# EAGLE design usb-fanctl (EAGLE 9.6.2)
CREVISION: 1; DESIGNER: Joao Silva
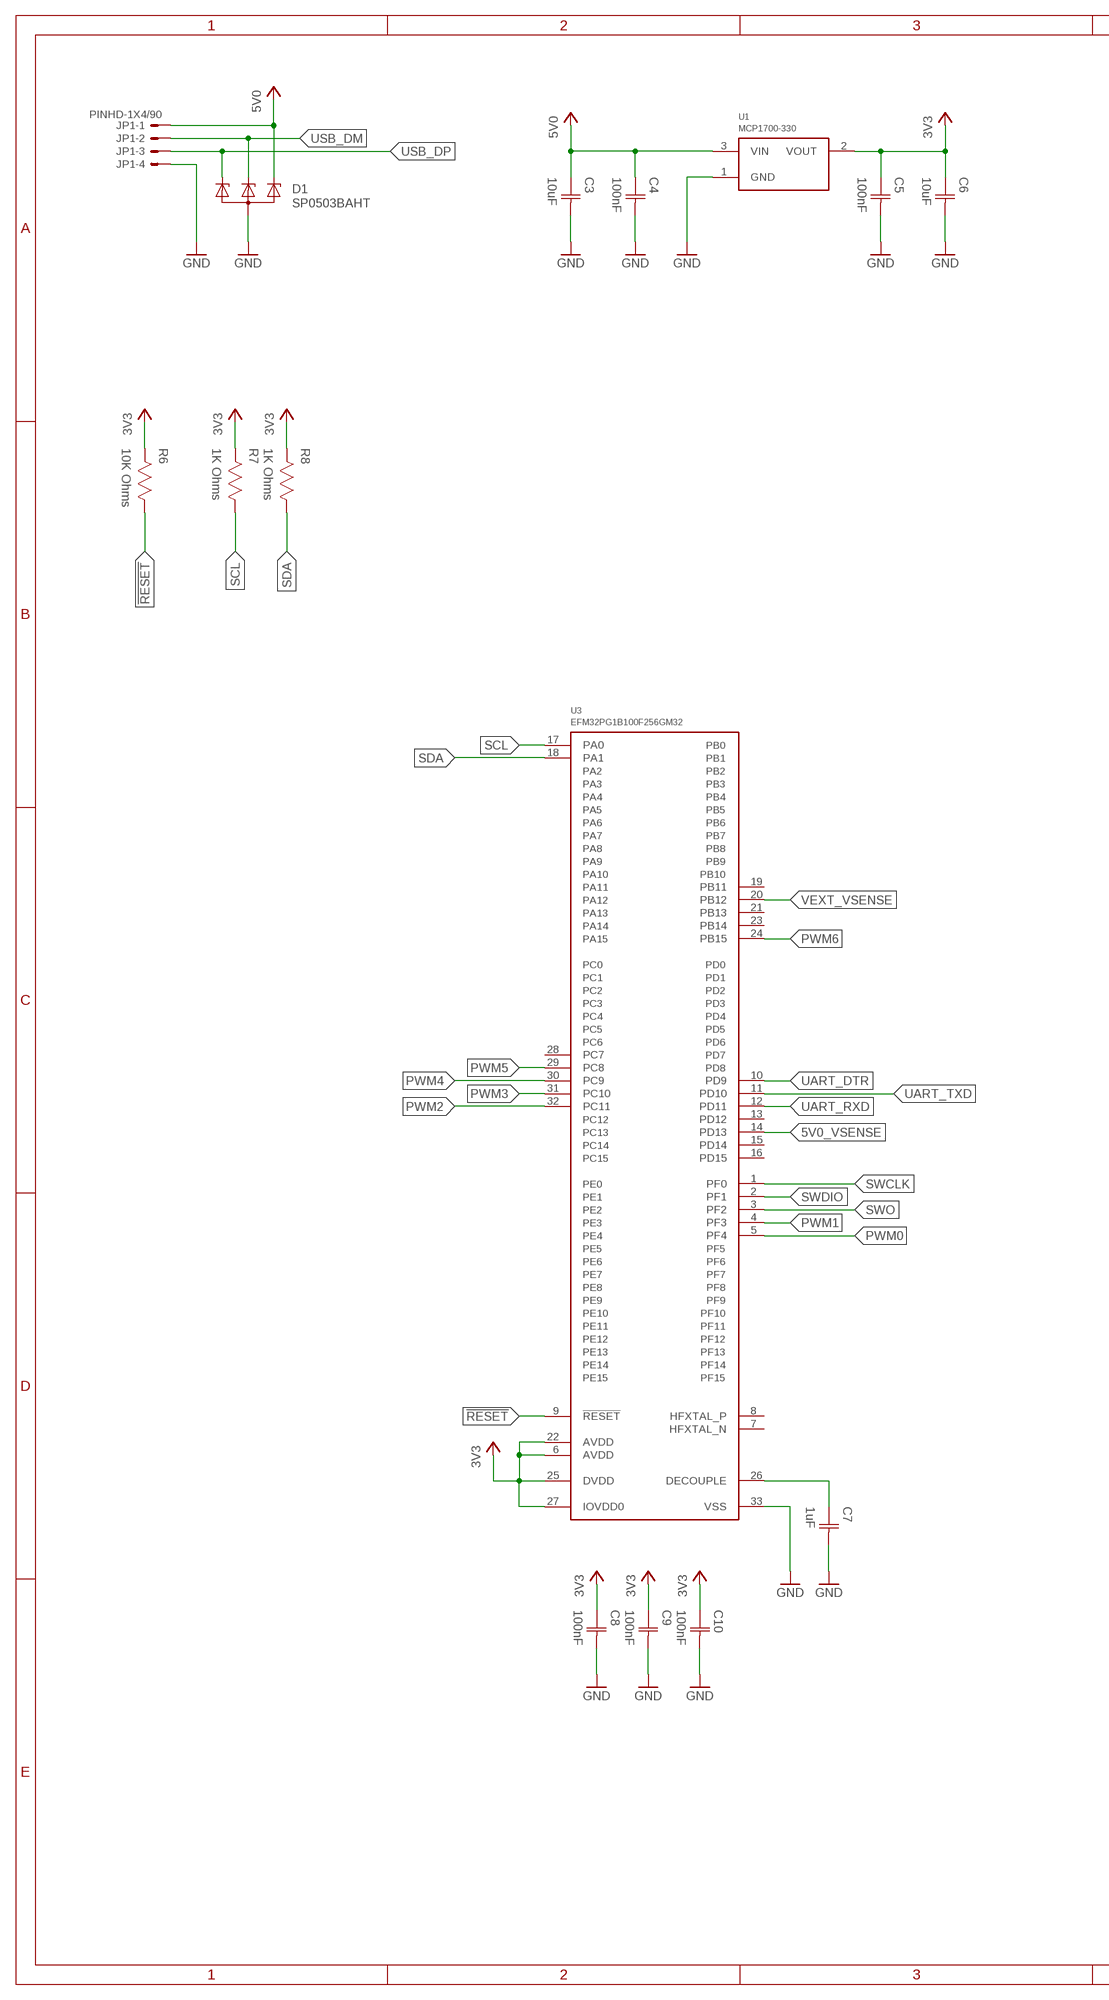
[diagram p0: schematic, sheet 1, part 1 of 2]
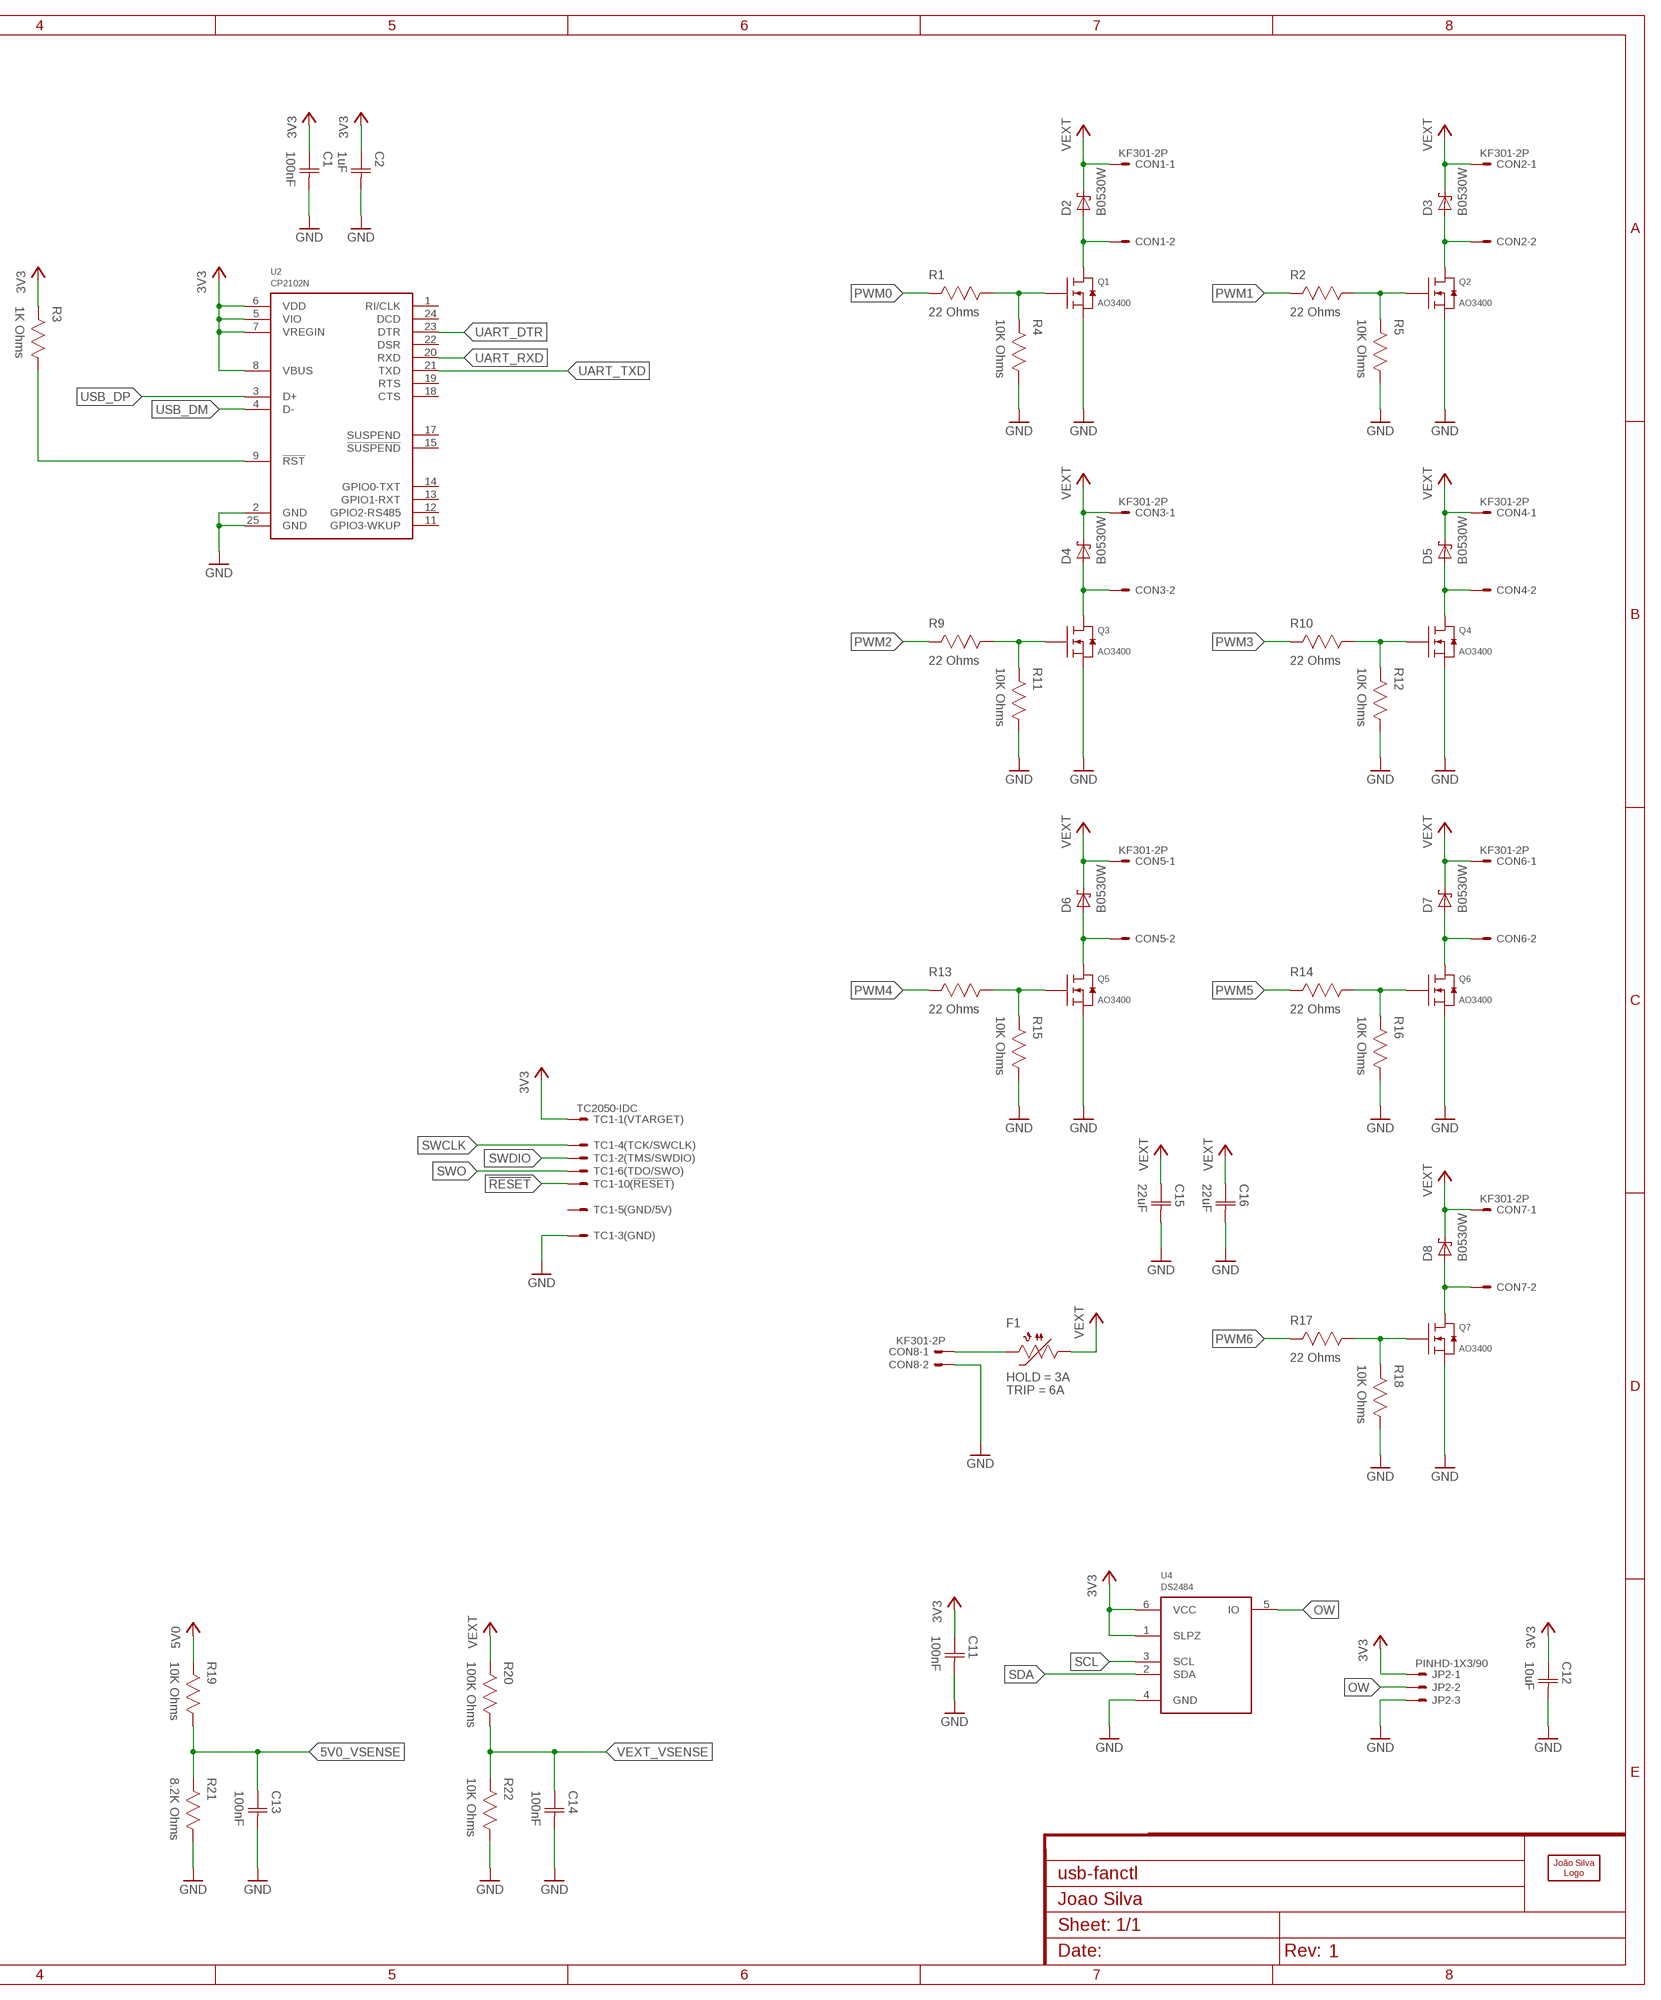
[diagram p1: schematic, sheet 1, part 2 of 2]

## Parts
C1  100nF  CAPACITOR-0402  [CAP0402]
C2  1uF  CAPACITOR-0402  [CAP0402]
C3  10uF  CAPACITOR-0603  [CAP0603]
C4  100nF  CAPACITOR-0402  [CAP0402]
C5  100nF  CAPACITOR-0402  [CAP0402]
C6  10uF  CAPACITOR-0603  [CAP0603]
C7  1uF  CAPACITOR-0402  [CAP0402]
C8  100nF  CAPACITOR-0402  [CAP0402]
C9  100nF  CAPACITOR-0402  [CAP0402]
C10  100nF  CAPACITOR-0402  [CAP0402]
C11  100nF  CAPACITOR-0402  [CAP0402]
C12  10uF  CAPACITOR-0603  [CAP0603]
C13  100nF  CAPACITOR-0402  [CAP0402]
C14  100nF  CAPACITOR-0402  [CAP0402]
C15  22uF  CAPACITOR-1206  [CAP1206]
C16  22uF  CAPACITOR-1206  [CAP1206]
CON1  KF301-2P  [KF301-2P]
CON2  KF301-2P  [KF301-2P]
CON3  KF301-2P  [KF301-2P]
CON4  KF301-2P  [KF301-2P]
CON5  KF301-2P  [KF301-2P]
CON6  KF301-2P  [KF301-2P]
CON7  KF301-2P  [KF301-2P]
CON8  KF301-2P  [KF301-2P]
D1  SP0503BAHT  [SOT143]
D2  B0530W  [SOD-123]
D3  B0530W  [SOD-123]
D4  B0530W  [SOD-123]
D5  B0530W  [SOD-123]
D6  B0530W  [SOD-123]
D7  B0530W  [SOD-123]
D8  B0530W  [SOD-123]
F1  PTC1206  [1206]
JP1  PINHD-1X4/90  [1X04/90]
JP2  PINHD-1X3/90  [1X03/90]
LOGO1  JS-5MM  [JS_5MM]
Q1  AO3400  [SOT23]
Q2  AO3400  [SOT23]
Q3  AO3400  [SOT23]
Q4  AO3400  [SOT23]
Q5  AO3400  [SOT23]
Q6  AO3400  [SOT23]
Q7  AO3400  [SOT23]
R1  22 Ohms  RESISTOR-0402  [RES0402]
R2  22 Ohms  RESISTOR-0402  [RES0402]
R3  1K Ohms  RESISTOR-0402  [RES0402]
R4  10K Ohms  RESISTOR-0402  [RES0402]
R5  10K Ohms  RESISTOR-0402  [RES0402]
R6  10K Ohms  RESISTOR-0402  [RES0402]
R7  1K Ohms  RESISTOR-0402  [RES0402]
R8  1K Ohms  RESISTOR-0402  [RES0402]
R9  22 Ohms  RESISTOR-0402  [RES0402]
R10  22 Ohms  RESISTOR-0402  [RES0402]
R11  10K Ohms  RESISTOR-0402  [RES0402]
R12  10K Ohms  RESISTOR-0402  [RES0402]
R13  22 Ohms  RESISTOR-0402  [RES0402]
R14  22 Ohms  RESISTOR-0402  [RES0402]
R15  10K Ohms  RESISTOR-0402  [RES0402]
R16  10K Ohms  RESISTOR-0402  [RES0402]
R17  22 Ohms  RESISTOR-0402  [RES0402]
R18  10K Ohms  RESISTOR-0402  [RES0402]
R19  10K Ohms  RESISTOR-0402  [RES0402]
R20  100K Ohms  RESISTOR-0402  [RES0402]
R21  8.2K Ohms  RESISTOR-0402  [RES0402]
R22  10K Ohms  RESISTOR-0402  [RES0402]
TC1  TC2050-IDC  [TC2050-IDC]
U1  MCP1700-330  [SOT23]
U2  CP2102N  [QFN24]
U3  EFM32PG1B100F256GM32  [QFN32_0.5P_JPG]
U4  DS2484  [SOT23-6]

## Nets
3V3: C1.1(C1) C2.1(C1) C5.1(C1) C6.1(C1) C8.1(C1) C9.1(C1) C10.1(C1) C11.1(C1) C12.1(C1) JP2.1 R3.2 R6.2 R7.2 R8.2 TC1.1 U1.2(VOUT) U2.5(VIO) U2.6(VDD) U2.7(VREGIN) U2.8(VBUS) U3.6(AVDD) U3.22(AVDD) U3.25(DVDD) U3.27(IOVDD0) U4.1(SLPZ) U4.6(VCC)
5V0: C3.1(C1) C4.1(C1) D1.4(C3) JP1.1 R19.2 U1.3(VIN)
5V0_VSENSE: C13.1(C1) R19.1 R21.2 U3.14(PD13)
!RESET: R6.1 TC1.10 U3.9(!RESET)
GND: C1.2(C2) C2.2(C2) C3.2(C2) C4.2(C2) C5.2(C2) C6.2(C2) C7.2(C2) C8.2(C2) C9.2(C2) C10.2(C2) C11.2(C2) C12.2(C2) C13.2(C2) C14.2(C2) C15.2(C2) C16.2(C2) CON8.2 D1.1(A) JP1.4 JP2.3 Q1.2(S) Q2.2(S) Q3.2(S) Q4.2(S) Q5.2(S) Q6.2(S) Q7.2(S) R4.1 R5.1 R11.1 R12.1 R15.1 R16.1 R18.1 R21.1 R22.1 TC1.3 U1.1(GND) U2.2(GND) U2.25(GND) U3.33(VSS) U4.4(GND)
N$1: Q2.1(G) R2.1 R5.2
N$2: CON2.2 D3.A Q2.3(D)
N$3: Q4.1(G) R10.1 R12.2
N$4: CON4.2 D5.A Q4.3(D)
N$5: Q6.1(G) R14.1 R16.2
N$6: CON6.2 D7.A Q6.3(D)
N$7: Q7.1(G) R17.1 R18.2
N$8: CON7.2 D8.A Q7.3(D)
N$9: Q1.1(G) R1.1 R4.2
N$10: CON1.2 D2.A Q1.3(D)
N$11: Q3.1(G) R9.1 R11.2
N$12: CON3.2 D4.A Q3.3(D)
N$13: Q5.1(G) R13.1 R15.2
N$14: CON5.2 D6.A Q5.3(D)
N$15: C7.1(C1) U3.26(DECOUPLE)
N$16: R3.1 U2.9(!RST)
OW: JP2.2 U4.5(IO)
PWM0: R1.2 U3.5(PF4)
PWM1: R2.2 U3.4(PF3)
PWM2: R9.2 U3.32(PC11)
PWM3: R10.2 U3.31(PC10)
PWM4: R13.2 U3.30(PC9)
PWM5: R14.2 U3.29(PC8)
PWM6: R17.2 U3.24(PB15)
SCL: R7.1 U3.17(PA0) U4.3(SCL)
SDA: R8.1 U3.18(PA1) U4.2(SDA)
SWCLK: TC1.4 U3.1(PF0)
SWDIO: TC1.2 U3.2(PF1)
SWO: TC1.6 U3.3(PF2)
UART_DTR: U2.23(DTR) U3.10(PD9)
UART_RXD: U2.20(RXD) U3.12(PD11)
UART_TXD: U2.21(TXD) U3.11(PD10)
USB_DM: D1.3(C2) JP1.2 U2.4(D-)
USB_DP: D1.2(C1) JP1.3 U2.3(D+)
VEXT: C15.1(C1) C16.1(C1) CON1.1 CON2.1 CON3.1 CON4.1 CON5.1 CON6.1 CON7.1 D2.C D3.C D4.C D5.C D6.C D7.C D8.C F1.1 R20.2
VEXT_UNFUSED: CON8.1 F1.2
VEXT_VSENSE: C14.1(C1) R20.1 R22.2 U3.20(PB12)
Unconnected: TC1.5 TC1.7 TC1.8 TC1.9 U2.1(RI/CLK) U2.11(GPIO3-WKUP) U2.12(GPIO2-RS485) U2.13(GPIO1-RXT) U2.14(GPIO0-TXT) U2.15(!SUSPEND) U2.17(SUSPEND) U2.18(CTS) U2.19(RTS) U2.22(DSR) U2.24(DCD) U3.7(HFXTAL_N) U3.8(HFXTAL_P) U3.13(PD12) U3.15(PD14) U3.16(PD15) U3.19(PB11) U3.21(PB13) U3.23(PB14) U3.28(PC7)

## Library data of the parts
C1-C16 = Capacitor:CAPACITOR
CON1-CON8 = Generic Connector:KF301-2P
D1 = TVS:SP0503BAHT
D2-D8 = Generic Diode:B0530W
F1 = Fuses:PTC; HOLD: 3A; TRIP: 6A
JP1 = Pin Header:PINHD-1X4: PIN HEADER
JP2 = Pin Header:PINHD-1X3: PIN HEADER
LOGO1 = Silkscreen:JS
Q1-Q7 = Alpha Omega:AO3400
R1-R22 = Resistor:RESISTOR
TC1 = TagConnect:TC2050-IDC
U1 = Microchip:MCP1700-*
U2 = Silicon Labs:CP2102N
U3 = EFM32:EFM32PG1B100F*M32
U4 = Maxim Integrated:DS2484

## Board
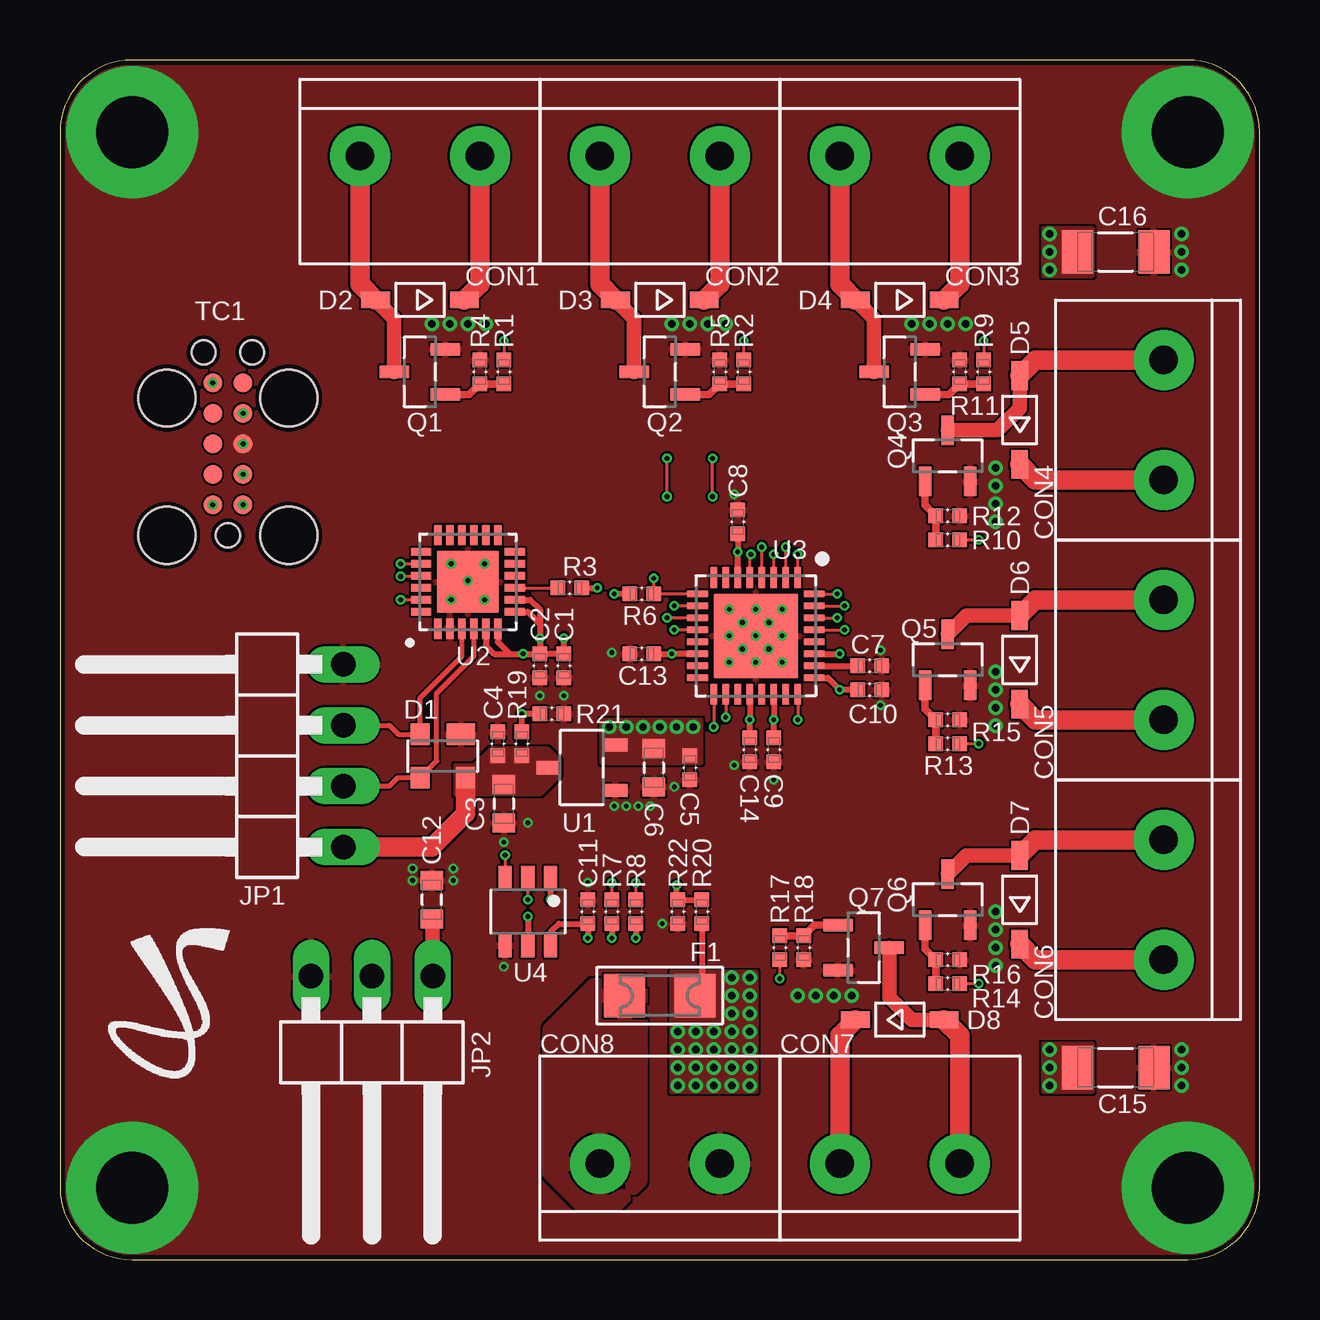
[diagram p2: board, top side]
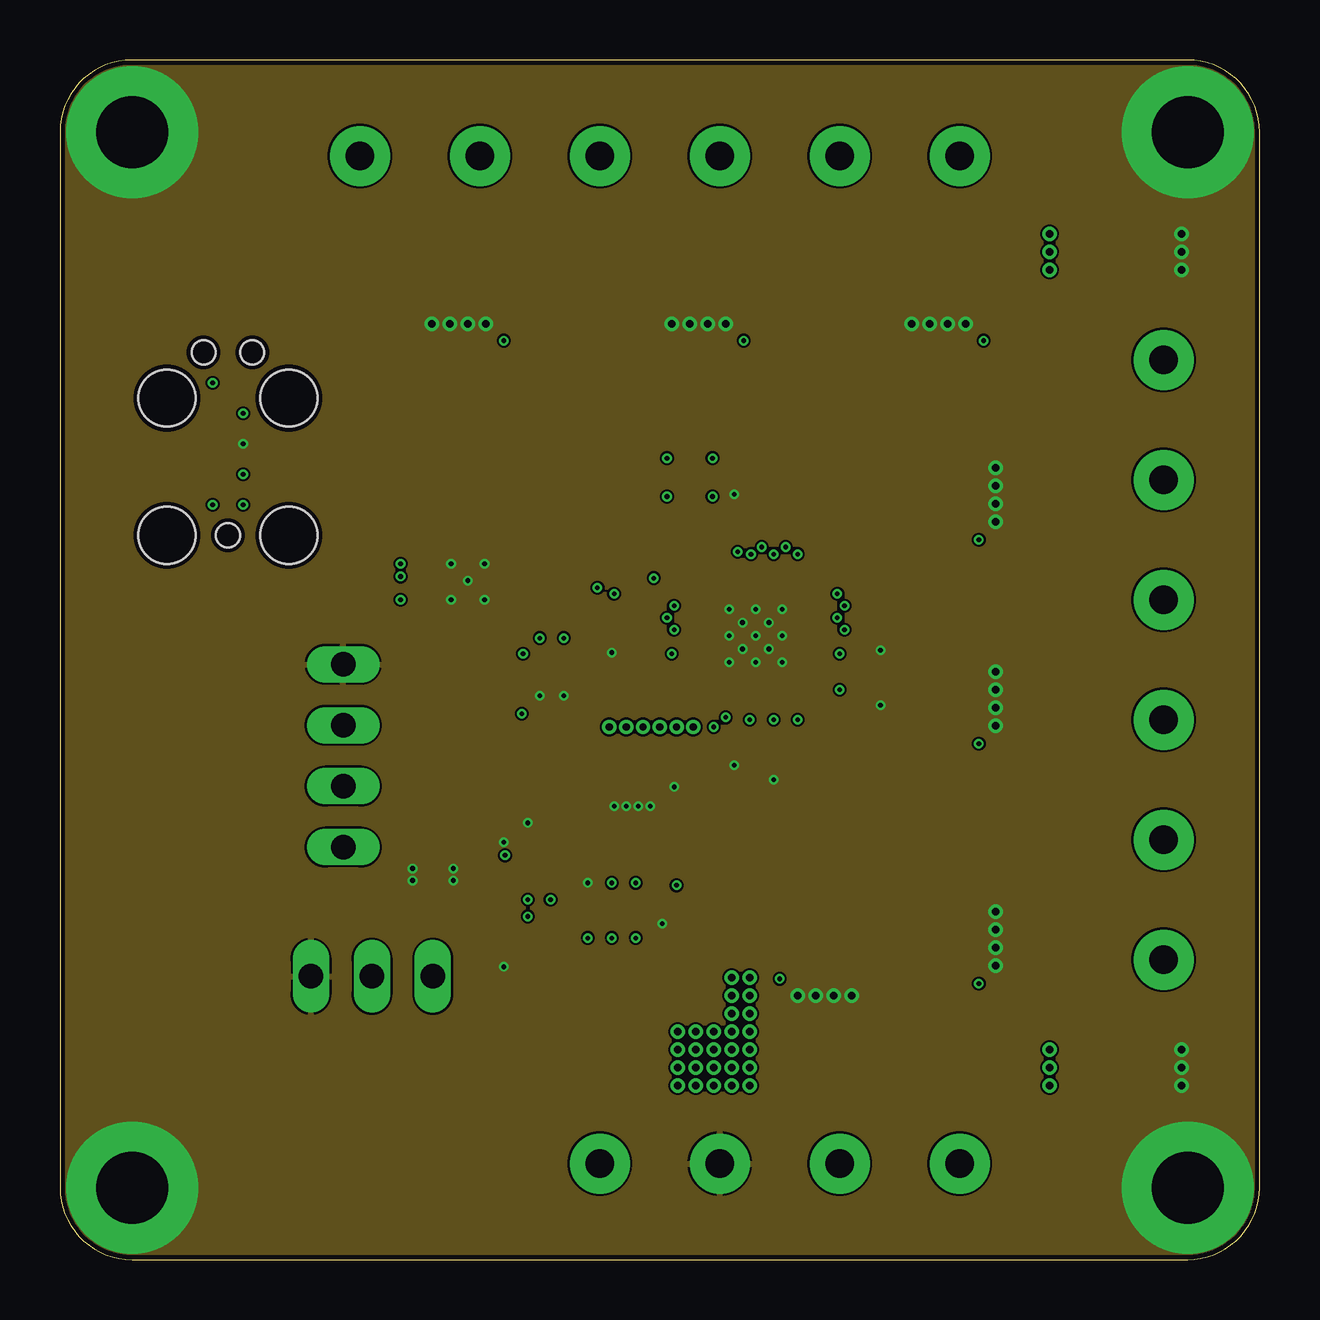
[diagram p3: board, inner layer Route2]
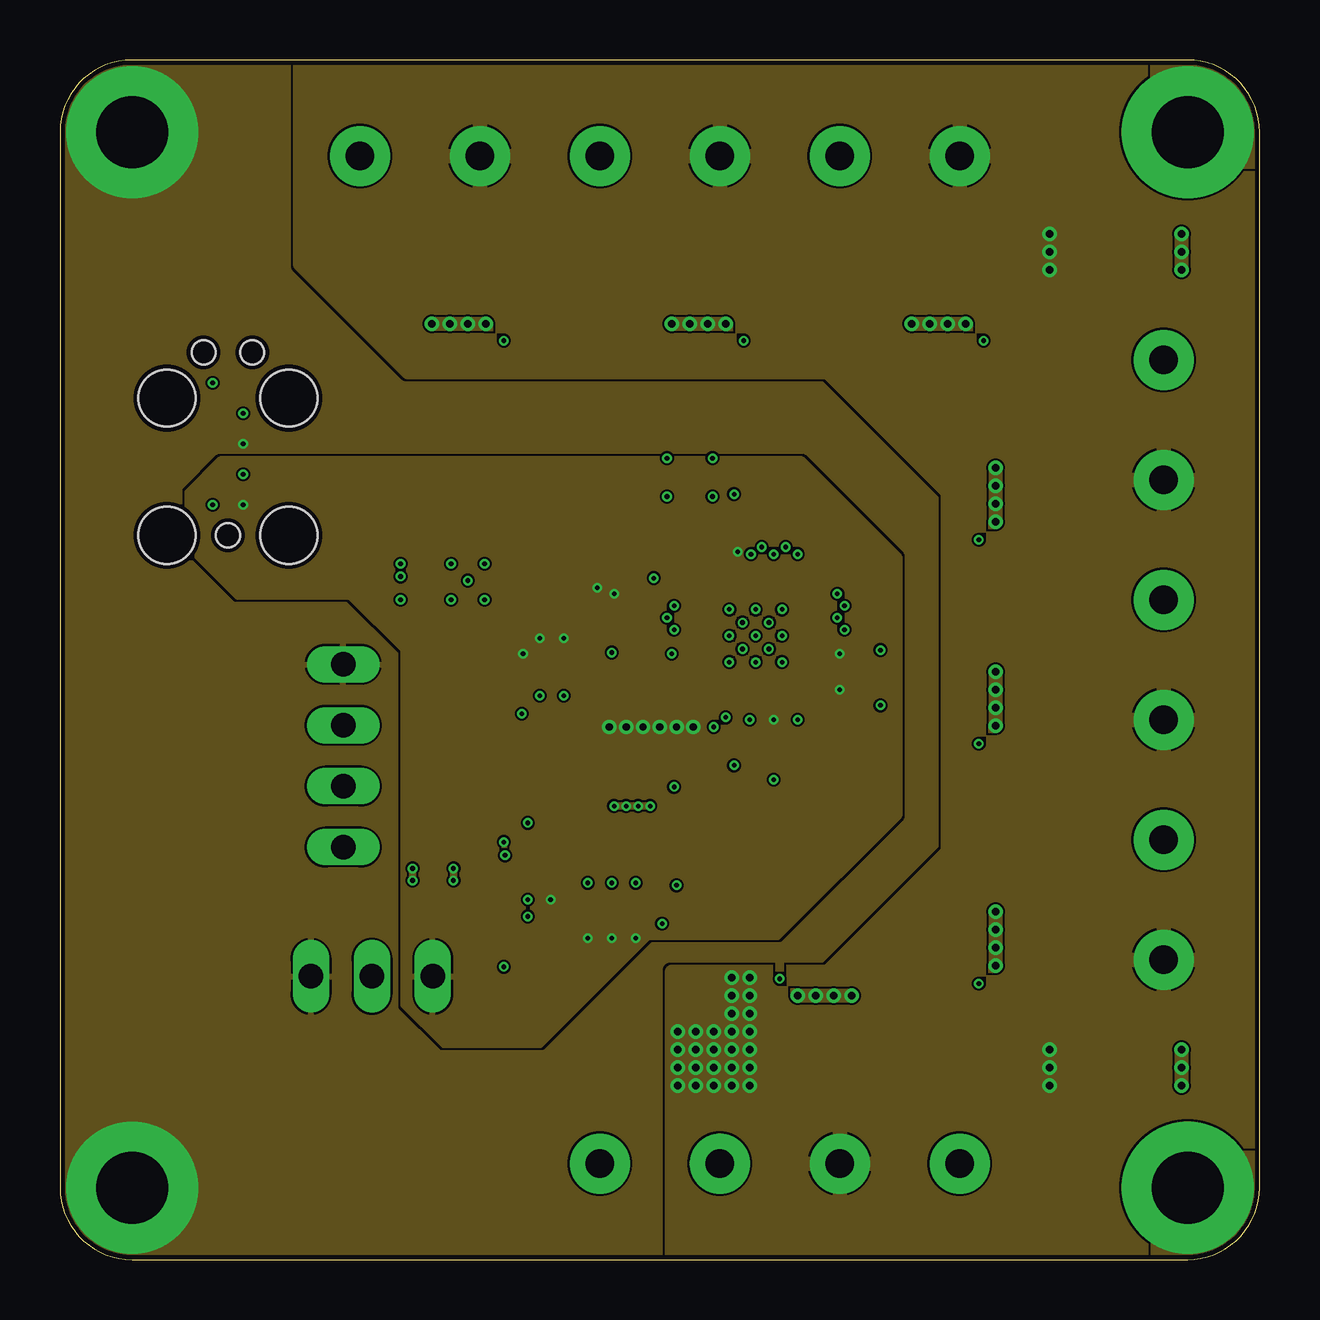
[diagram p4: board, inner layer Route15]
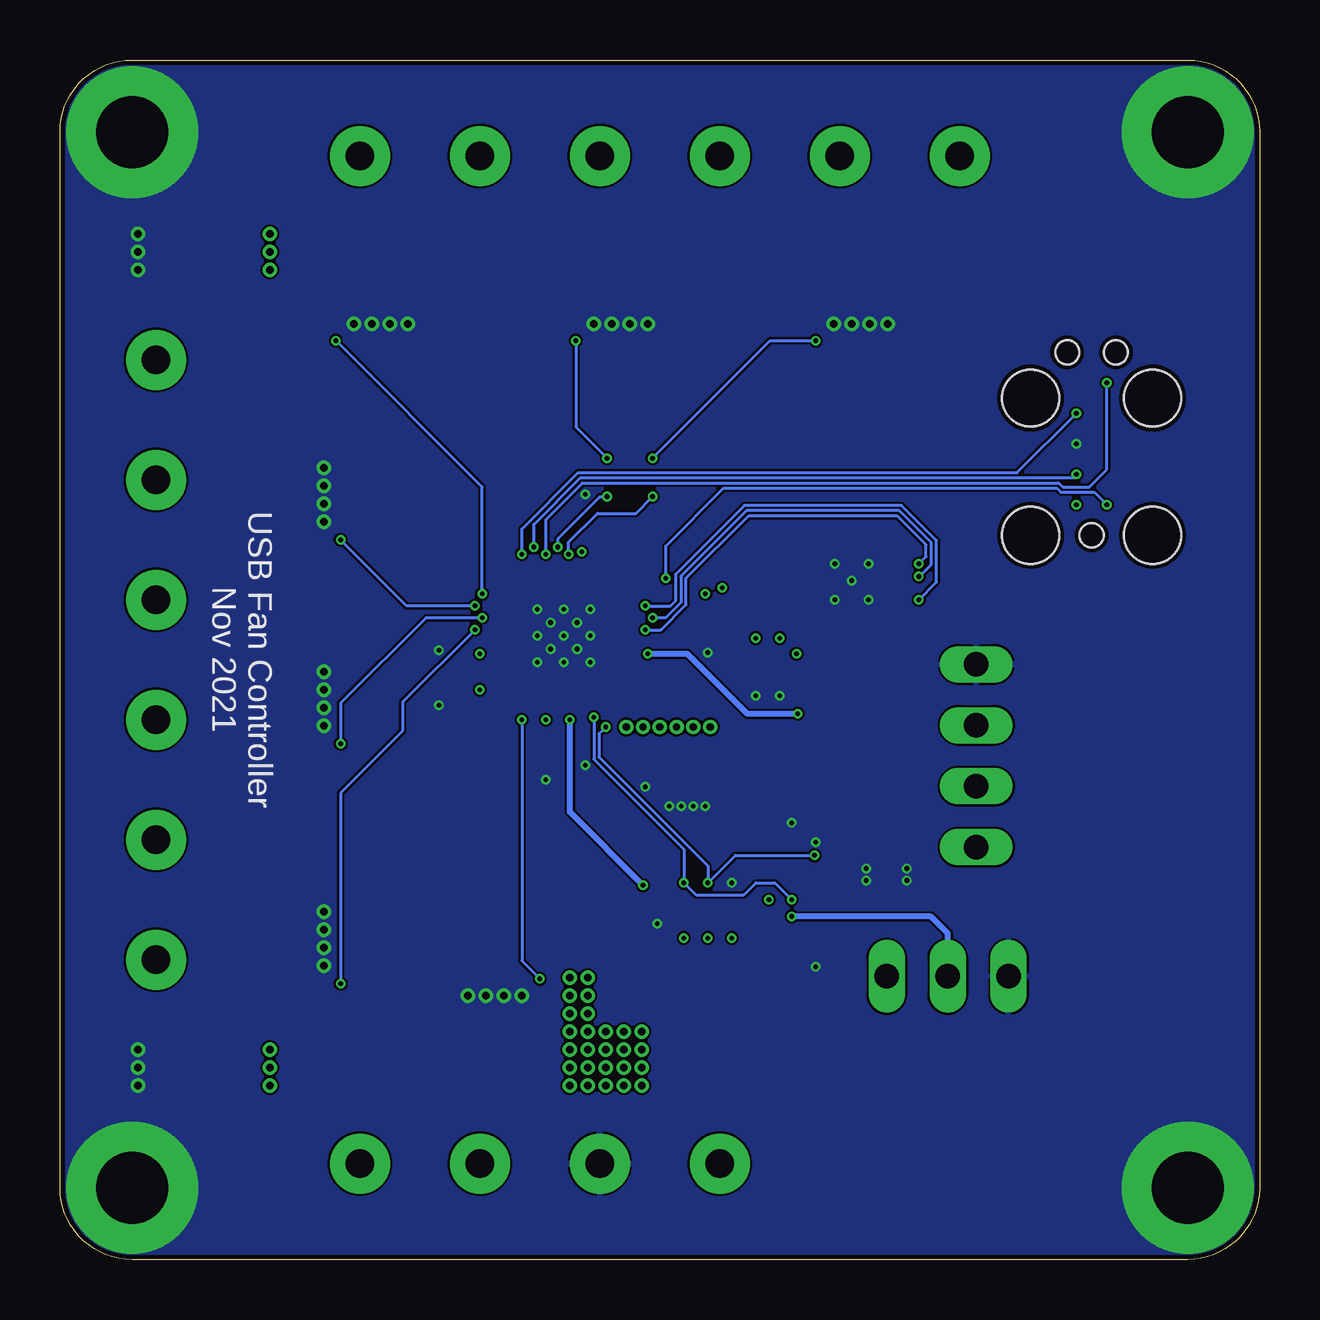
[diagram p5: board, bottom side, seen from below]

Size 50 x 50 mm. Coordinates in mm from the lower left corner, seen from the top.
Outline: 0,47 0,3 arc90 3,0 47,0 arc90 50,3 50,47 arc90 47,50 3,50 arc90 0,47
Copper layers (1+2*15+16): Top 0.035mm / dielectric 0.2mm / Route2 0.0175mm / dielectric 0.665mm / Route15 0.0175mm / dielectric 0.2mm / Bottom 0.035mm
Design rules "jlcpcb_4layer": minimum track width 3.5mil, minimum drill 0.2mm, track to track 3.5mil, track to pad 3.5mil, pad to pad 3.5mil, via to via 5mil, smd to smd 3.5mil, copper to edge 0.2mm, drill to drill 5mil, minimum pad ring 0.15mm, minimum via ring 0.1mm, stop-mask expansion 0.04mm, vias tented up to drill 10mm, thermal gap 3.5mil

### Footprints (pad centres in the part's own frame; a part is rotated, then mirrored left to right if it is on the bottom)
CAP0402 = smd 0.6 x 0.6: 1 -0.5,0; 2 0.5,0
CAP0603 = smd 0.8 x 0.95: 1 -0.8,0; 2 0.8,0
CAP1206 = smd 1.3 x 1.8: 1 -1.6,0; 2 1.6,0
KF301-2P = drill 1.2 pad 2.5: 1 -2.5,0; 2 2.5,0
SOT143 = smd 1.2 x 0.9: 1 -0.711,-0.889 | smd 0.8 x 0.9: 2 0.989,-0.889; 3 0.989,0.911; 4 -0.911,0.911
SOD-123 = smd 1.2 x 0.7: A 1.85,0; C -1.85,0
1206 = smd 1.7 x 1.803: 1 -1.472,0; 2 1.472,0
1X04/90 = drill 1.016 long: 1 -3.81,-3.81; 2 -1.27,-3.81; 3 1.27,-3.81; 4 3.81,-3.81
1X03/90 = drill 1.016 long: 1 -2.54,-3.81; 2 0,-3.81; 3 2.54,-3.81
SOT23 = smd 1.219 x 0.533: 1 -1.067,0.94; 2 -1.067,-0.94; 3 1.067,0
RES0402 = smd 0.6 x 0.6: 1 -0.5,0; 2 0.5,0
TC2050-IDC = smd 0.787 x 0.787: 1 -2.54,-0.635; 2 -1.27,-0.635; 3 0,-0.635; 4 1.27,-0.635; 5 2.54,-0.635; 6 2.54,0.635; 7 1.27,0.635; 8 0,0.635; 9 -1.27,0.635; 10 -2.54,0.635 | hole 0.991: -3.81,0; 3.81,1.016; 3.81,-1.016 | hole 2.375: -3.81,2.54; -3.81,-2.54; 1.905,2.54; 1.905,-2.54
SOT23' = smd 1 x 0.55: 1 -1.4,0.95; 2 -1.4,-0.95; 3 1.394,0
QFN24 = smd 0.3 x 0.85: 1 -1.25,-1.95; 2 -0.75,-1.95; 3 -0.25,-1.95; 4 0.25,-1.95; 5 0.75,-1.95; 6 1.25,-1.95; 13 1.25,1.95; 14 0.75,1.95; 15 0.25,1.95; 16 -0.25,1.95; 17 -0.75,1.95; 18 -1.25,1.95 | smd 0.85 x 0.3: 7 1.95,-1.25; 8 1.95,-0.75; 9 1.95,-0.25; 10 1.95,0.25; 11 1.95,0.75; 12 1.95,1.25; 19 -1.95,1.25; 20 -1.95,0.75; 21 -1.95,0.25; 22 -1.95,-0.25; 23 -1.95,-0.75; 24 -1.95,-1.25 | smd 2.55 x 2.55: 25 0,0
QFN32_0.5P_JPG = smd 0.86 x 0.26: 1 -2.43,1.75; 2 -2.43,1.25; 3 -2.43,0.75; 4 -2.43,0.25; 5 -2.43,-0.25; 6 -2.43,-0.75; 7 -2.43,-1.25; 8 -2.43,-1.75; 17 2.43,-1.75; 18 2.43,-1.25; 19 2.43,-0.75; 20 2.43,-0.25; 21 2.43,0.25; 22 2.43,0.75; 23 2.43,1.25; 24 2.43,1.75 | smd 0.26 x 0.86: 9 -1.75,-2.43; 10 -1.25,-2.43; 11 -0.75,-2.43; 12 -0.25,-2.43; 13 0.25,-2.43; 14 0.75,-2.43; 15 1.25,-2.43; 16 1.75,-2.43; 25 1.75,2.43; 26 1.25,2.43; 27 0.75,2.43; 28 0.25,2.43; 29 -0.25,2.43; 30 -0.75,2.43; 31 -1.25,2.43; 32 -1.75,2.43 | smd 3.5 x 3.5: 33 0,0
SOT23-6 = smd 1 x 0.55: 1 -1.4,0.95; 2 -1.4,0; 3 -1.4,-0.95; 4 1.4,-0.95; 5 1.4,0; 6 1.4,0.95

### Placement (x,y rotation side)
C1  21,24.75 270 top
C2  20,24.75 270 top
C3  18.5,19 270 top
C4  18.25,21.5 90 top
C5  26.25,20.5 270 top
C6  24.75,20.5 270 top
C7  33.75,24.75 0 top
C8  28.25,30.75 90 top
C9  29.75,21.25 270 top
C10  33.75,23.75 0 top
C11  22,14.5 90 top
C12  15.5,15 90 top
C13  24.25,25.25 180 top
C14  28.75,21.25 270 top
C15  44,8 0 top
C16  44,42 0 top
CON1  15,46 180 top
CON2  25,46 180 top
CON3  35,46 180 top
CON4  46,35 90 top
CON5  46,25 90 top
CON6  46,15 90 top
CON7  35,4 0 top
CON8  25,4 0 top
D1  16,21 180 top
D2  15,40 180 top
D3  25,40 180 top
D4  35,40 180 top
D5  40,35 90 top
D6  40,25 90 top
D7  40,15 90 top
D8  35,10 0 top
F1  25,11 180 top
JP1  8,21 90 top
JP2  13,8 180 top
LOGO1  7.25,14 0 top
Q1  15,37 180 top
Q2  25,37 180 top
Q3  35,37 180 top
Q4  37,33.5 90 top
Q5  37,25 90 top
Q6  37,15 90 top
Q7  33.5,13 0 top
R1  18.5,37 90 top
R2  28.5,37 90 top
R3  21.25,28 0 top
R4  17.5,37 270 top
R5  27.5,37 270 top
R6  24.25,27.75 180 top
R7  23,14.5 270 top
R8  24,14.5 270 top
R9  38.5,37 90 top
R10  37,30 0 top
R11  37.5,37 270 top
R12  37,31 180 top
R13  37,21.5 0 top
R14  37,11.5 0 top
R15  37,22.5 180 top
R16  37,12.5 180 top
R17  30,13 270 top
R18  31,13 90 top
R19  19.25,21.5 270 top
R20  26.75,14.5 270 top
R21  20.5,22.75 180 top
R22  25.75,14.5 90 top
TC1  7,34 90 top
U1  MCP1700-330  [SOT23']  21.75,20.5 180 top
U2  17,28.25 0 top
U3  29,26 270 top
U4  19.5,14.5 270 top

### Tracks (layer width: path | path; a pad name or v marks a point on that pad's centre or on a via)
3V3  (via drill 0.2, 0.3)
  Top 0.254: U3.6 v28.25,29.5 C8.1 | U3.22 v29.75,22.5 C9.1 | U3.25 32,24.25 v32.5,23.75 C10.1 | U3.27 v32.5,25.25 | U2.6 18.25,25.75 18.75,25.25 | 18.75,25.25 v19.3,25.25 C2.1 | U2.5 17.75,25.6 18.1,25.25 18.75,25.25 | C2.1 C1.1 v21,25.9 | U2.7 19.5,27 20,26.5 | C2.1 v20,25.9 20,26.5 | U2.8 19.6,27.5 20,27.1 20,26.5 | R3.2 v22.4,28 | R6.2 v23.1,27.75 | v22,13.4 C11.1 20.8,14 20.45,13.65 U4.6 | U4.1 v20.45,15 | R7.2 v23,13.4 | R8.2 v24,13.4
  Top 0.61: JP2.1 15.54,14.16 C12.1
  other vias: 26.4,22.2 25.7,22.2 25,22.2 24.3,22.2 23.6,22.2 22.9,22.2 7.63,31.46
  pour Top (no thermals): 22.6,20.7 22.6,22.5 26.7,22.5 26.7,20.7
  pour Route15: 20,8.9 16,8.9 14.3,10.6 14.3,25.4 12.1,27.6 7.4,27.6 5.3,29.7 5.3,32 6.7,33.4 30.9,33.4 35,29.3 35,18.5 29.9,13.4 24.5,13.4
5V0
  Top 0.813: JP1.1 15.51,17.19 16.91,18.59 D1.4
  pour Top (no thermals): 16.5,20.6 17.3,20.6 18,21.3 20.3,21.3 20.8,20.8 20.8,20.2 20,19.4 18.2,19.4 16.5,19.4
5V0_VSENSE  (via drill 0.2)
  Top 0.254: C13.1 v25.5,25.25 U3.14 | R19.1 v19.25,22.75 R21.2
  Bottom 0.254: v19.25,22.75 21.35,22.75 23.85,25.25 v25.5,25.25
!RESET  (via drill 0.2)
  Top 0.127: U3.9 R6.1 v24.75,28.4
  Bottom 0.127: v24.75,28.4 24.75,29.75 22.35,32.15 8.46,32.15 8.29,31.98 6.89,31.98 TC1.10
  other vias: 6.37,31.46
GND  (via drill 0.2, 0.3, 3 pad 5.5)
  other vias: 3,47 3,3 47,3 47,47 17.75,39 17,39 15.5,39 16.25,39 30.75,11 31.5,11 33,11 32.25,11 39,12.25 39,13 39,14.5 39,13.75 39,22.25 39,23 39,24.5 39,23.75 39,30.75 39,31.5 39,33 39,32.25 37.75,39 37,39 35.5,39 36.25,39 27.75,39 27,39 25.5,39 26.25,39 7.63,34 30.1,27.1 29,27.1 27.9,27.1 30.1,24.9 29,24.9 27.9,24.9 30.1,26 29,26 27.9,26 28.45,25.45 28.45,26.55 29.55,26.55 29.55,25.45 17,28.3 16.3,29 17.7,29 17.7,27.5 16.3,27.5 23,25.3 20,23.5 21,23.5 19.5,18.2 18.5,17.4 25.6,19.7 24.6,18.9 24.1,18.9 23.6,18.9 23.1,18.9 22,15.7 25.1,14 14.7,16.3 14.7,15.8 16.4,15.8 16.4,16.3 28.1,20.6 29.75,20 34.2,25.4 34.2,23.1 28.1,31.9 18.5,12.2 46.75,8.75 46.75,8 46.75,7.25 46.75,42.75 46.75,42 46.75,41.25
  pour Top (rank 6): -1,-1 51,-1 51,51 -1,51
  pour Route2 (rank 6): -2,-2 52,-2 52,52 -2,52
  pour Route15 (rank 6): -3,-3 53,-3 53,53 -3,53
  pour Bottom (rank 6): -4,-4 54,-4 54,54 -4,54
N$1
  Top 0.305: Q2.1 27.06,36.06 R5.2 R2.1
N$2
  Top 0.61: Q2.3 23.93,39.22 D3.A
  Top 0.813: D3.A 22.5,40.65 CON2.2
N$3
  Top 0.305: Q4.1 36.06,31.44 R12.2 R10.1
N$4
  Top 0.61: Q4.3 39.07,34.57 40,35.5 D5.A
  Top 0.813: D5.A 40.65,37.5 CON4.2
N$5
  Top 0.305: Q6.1 36.06,12.94 R16.2 R14.1
N$6
  Top 0.61: Q6.3 37.78,16.85 D7.A
  Top 0.813: D7.A 40.65,17.5 CON6.2
N$7
  Top 0.305: Q7.1 31.44,13.94 R18.2 R17.1
N$8
  Top 0.61: Q7.3 34.57,10.93 35.5,10 D8.A
  Top 0.813: D8.A 37.5,9.35 CON7.2
N$9
  Top 0.305: Q1.1 17.06,36.06 R4.2 R1.1
N$10
  Top 0.61: Q1.3 13.93,39.22 D2.A
  Top 0.813: D2.A 12.5,40.65 CON1.2
N$11
  Top 0.305: Q3.1 37.06,36.06 R11.2 R9.1
N$12
  Top 0.61: Q3.3 33.93,39.22 D4.A
  Top 0.813: D4.A 32.5,40.65 CON3.2
N$13
  Top 0.305: Q5.1 36.06,22.94 R15.2 R13.1
N$14
  Top 0.61: Q5.3 37.78,26.85 D6.A
  Top 0.813: D6.A 40.65,27.5 CON5.2
N$15
  Top 0.254: U3.26 C7.1
N$16
  Top 0.127: U2.9 R3.1
OW  (via drill 0.2)
  Top 0.254: v19.5,14.3 U4.5
  Bottom 0.254: JP2.2 13,13.6 13.7,14.3 v19.5,14.3
PWM0  (via drill 0.2)
  Top 0.127: U3.5 28.75,29.35 v28.8,29.4 | v25.3,31.8 v25.3,33.4 | v18.5,38.3 R1.2
  Bottom 0.127: v28.8,29.4 28.8,29.9 27.6,31.1 26,31.1 v25.3,31.8 | v25.3,33.4 20.4,38.3 v18.5,38.3
PWM1  (via drill 0.2)
  Top 0.127: U3.4 v29.25,29.7 | v27.2,31.8 v27.2,33.4 | R2.2 v28.5,38.3
  Bottom 0.127: v29.25,29.7 29.25,30.05 27.5,31.8 v27.2,31.8 | v28.5,38.3 28.5,34.7 v27.2,33.4
PWM2  (via drill 0.2)
  Top 0.127: U3.32 v32.4,27.75 | v38.5,38.3 R9.2
  Bottom 0.127: v32.4,27.75 32.4,32.2 v38.5,38.3
PWM3  (via drill 0.2)
  Top 0.127: U3.31 v32.7,27.25 | v38.3,30 R10.2
  Bottom 0.127: v32.7,27.25 35.55,27.25 v38.3,30
PWM4  (via drill 0.2)
  Top 0.127: U3.30 v32.4,26.75 | v38.3,21.5 R13.2
  Bottom 0.127: v32.4,26.75 34.75,26.75 38.3,23.2 v38.3,21.5
PWM5  (via drill 0.2)
  Top 0.127: U3.29 v32.7,26.25 | v38.3,11.5 R14.2
  Bottom 0.127: v38.3,11.5 38.3,19.45 35.71,22.04 35.71,23.24 v32.7,26.25
PWM6  (via drill 0.2)
  Top 0.127: U3.24 v30.75,22.5 | v30,11.7 R17.2
  Bottom 0.127: v30.75,22.5 30.75,12.45 v30,11.7
SCL  (via drill 0.2)
  Top 0.127: U3.17 v27.25,22.2 | R7.1 v23,15.7 | v18.55,16.85 U4.3
  Bottom 0.127: v27.25,22.2 27.53,21.92 27.53,20.94 23,16.41 v23,15.7 21.85,16.85 v18.55,16.85
SDA  (via drill 0.2)
  Top 0.127: U3.18 v27.75,22.6 | R8.1 v24,15.7 | v19.5,15 U4.2
  Bottom 0.127: v27.75,22.6 27.75,20.85 24,17.1 v24,15.7 23.5,15.2 21.5,15.2 21,15.7 20.2,15.7 v19.5,15
SWCLK  (via drill 0.2)
  Top 0.127: U3.1 v30.75,29.4
  Bottom 0.127: v30.75,29.4 30.75,30.45 28.4,32.8 10.11,32.8 TC1.4
  other vias: 7.63,35.27
SWDIO  (via drill 0.2)
  Top 0.127: U3.2 v30.25,29.7
  Bottom 0.127: v30.25,29.7 30.25,30.64 28.31,32.58 7.78,32.58 TC1.2
  other vias: 7.63,32.73
SWO  (via drill 0.2)
  Top 0.127: U3.3 v29.75,29.4
  Bottom 0.127: v29.75,29.4 29.75,30.84 28.22,32.37 8.37,32.37 8.2,32.2 7.1,32.2 6.37,32.94 TC1.6
  other vias: 6.37,36.54
UART_DTR  (via drill 0.2)
  Top 0.127: U2.23 v14.2,27.5 | U3.10 v25.6,27.25
  Bottom 0.127: v25.6,27.25 24.56,27.25 24.33,27.48 24.33,28.58 21.48,31.43 14.92,31.43 13.47,29.98 13.47,28.23 v14.2,27.5
UART_RXD  (via drill 0.2)
  Top 0.127: U2.20 v14.2,29 | U3.12 v25.6,26.25
  Bottom 0.127: v14.2,29 13.9,29.3 13.9,29.8 15.1,31 21.3,31 23.9,28.4 23.9,27.3 24.95,26.25 v25.6,26.25
UART_TXD  (via drill 0.2)
  Top 0.127: U2.21 15.02,28.47 v14.2,28.47 | U3.11 v25.3,26.75
  Bottom 0.127: v14.2,28.47 14.06,28.61 14.04,28.61 13.68,28.96 13.68,29.89 15.01,31.22 21.39,31.22 24.12,28.49 24.12,27.39 24.75,26.75 v25.3,26.75
USB_DM
  Top 0.2: JP1.2 13.73,19.73 14.09,20.09 D1.3 15.7,20.78 15.7,23.6 17.25,25.15 U2.4
USB_DP
  Top 0.2: JP1.3 13.73,22.27 14.11,21.89 D1.2 15.01,23.41 16.75,25.15 U2.3
VEXT  (via drill 0.3)
  Top 0.254: R20.2 26.75,11.28 F1.1
  Top 0.813: CON6.1 40.65,12.5 D7.C | D6.C 40.65,22.5 CON5.1 | D5.C 40.65,32.5 CON4.1 | D4.C 37.5,40.65 CON3.1 | D3.C 27.5,40.65 CON2.1 | D2.C 17.5,40.65 CON1.1 | D8.C 32.5,9.35 CON7.1
  other vias: 28.75,7.25 28,7.25 27.25,7.25 26.5,7.25 25.75,7.25 28.75,11.75 28,11.75 28.75,11 28,11 28.75,10.25 28,10.25 28.75,9.5 28,9.5 27.25,9.5 26.5,9.5 25.75,9.5 28.75,8.75 28,8.75 27.25,8.75 26.5,8.75 25.75,8.75 28.75,8 28,8 27.25,8 26.5,8 25.75,8 41.25,42.75 41.25,42 41.25,41.25 41.25,8.75 41.25,8 41.25,7.25
  pour Route15: 25.5,12 32,12 37,17 37,32 32,37 14.5,37 10,41.5 10,50 50,50 50,0 25.5,0
  pour Top (no thermals): 25.5,12 29,12 29,7 25.5,7
  pour Top (no thermals): 43,41 41,41 41,43 43,43
  pour Top (no thermals): 43,7 41,7 41,9 43,9
VEXT_UNFUSED
  pour Top: 21.7,2.3 23.2,2.3 24.2,3.3 24.2,11.6 22.4,11.6 20.4,9.6 20.4,3.6
VEXT_VSENSE  (via drill 0.2)
  Top 0.254: C14.1 v28.75,22.5 U3.20 | R20.1 R22.2 25.7,15.05 v25.7,15.6
  Bottom 0.254: v25.7,15.6 28.75,18.65 v28.75,22.5

### Text on the board
bPlace: USB Fan Controller / Nov 2021